# EAGLE design rev2.3.2 (EAGLE 9.3.0)
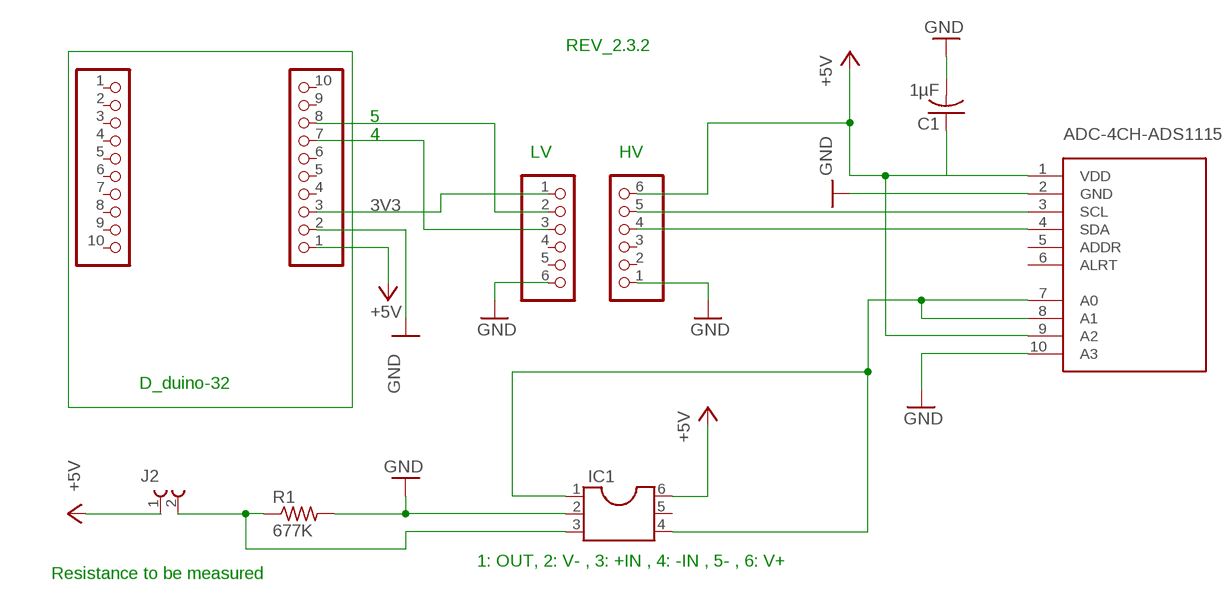
[diagram p0: schematic, sheet 1]

## Parts
C1  1µF  C-US025-025X050  [C025-025X050]
IC1  DIL6S  [SOCKET-06]
J2  691103110002  [691103110002]
JP1  PINHD-1X6  [1X06]
JP3  PINHD-1X10  [1X10]
JP4  PINHD-1X6  [1X06]
JP5  PINHD-1X10  [1X10]
R1  677K  R-US_0204/5  [0204/5]
U$1  ADC-4CH-ADS1115  [ADC-4CH-ADS1115]

## Nets
3V3: JP1.1
4: JP1.3
+5V: IC1.6 J2.1
A1: IC1.1 IC1.4 U$1.7(A0) U$1.8(A1)
GND: C1.2 IC1.2 JP1.6 JP4.1 JP5.2 R1.2 U$1.2(GND) U$1.10(A3)
N$1: IC1.3 J2.2 R1.1
N$2: JP1.2 JP5.8
N$3: U$1.1(VDD)
N$5: JP4.5 U$1.3(SCL)
N$6: JP4.4 U$1.4(SDA)
VDD: C1.1 JP4.6 U$1.9(A2) ; supply symbol labelled +5V
Unconnected: IC1.5 JP1.4 JP1.5 JP3.1 JP3.2 JP3.3 JP3.4 JP3.5 JP3.6 JP3.7 JP3.8 JP3.9 JP3.10 JP4.2 JP4.3 JP5.1 JP5.3 JP5.4 JP5.5 JP5.6 JP5.7 JP5.9 JP5.10 U$1.5(ADDR) U$1.6(ALRT)

## Notes on the sheet
- REV_2.3.2
- 5
- 4
- LV | HV
- D_duino-32
- Resistance to be measured | 1: OUT, 2: V- , 3: +IN , 4: -IN , 5- , 6: V+

## Library data of the parts
C1 = adafruit:C-US: CAPACITOR, American symbol
IC1 = ic-package:DIL6: Dual In Line / Socket
J2 = Wurth_Elektronik_Electromechanic_Terminal_Blocks_Connectors_rev18a:691103110002: WR-TBL Serie 1031 - 3.5mm Horizontal Entry Modular with Pressure Clamp - 1.5mm2 Wires, 2 Pins=>Code : Con_TBL_Screw_PressureClamp_6911103110002 <http://katalog.we-online.de/media/images/eican/Con_TBL_Screw_PressureClamp_69111031100xx_pf2.jpg> Details see: http://katalog.we-online.de/en/em/691_103_110_0xx Created 2014-06-16, Karrer Zheng 2014 (C) Würth Elektronik
JP1 JP4 = pinhead:PINHD-1X6: PIN HEADER
JP3 JP5 = pinhead:PINHD-1X10: PIN HEADER
R1 = adafruit:R-US_: RESISTOR, American symbol
U$1 = diy-modules:ADC-4CH-ADS1115: 4 Channel 16-Bit Analog-to-Digital Converter based on ADS1115 chip Arduino ADS1115 Getting Started Tutorial is available here: http://henrysbench.capnfatz.com/henrys-bench/arduino-voltage-measurements/arduino-ads1115-module-getting-started-tutorial/ ADS1115 datasheet is available here: http://www.ti.com/lit/ds/symlink/ads1115.pdf Click here to find device on ebay.com <http://www.ebay.com/sch/ads1115+module>

## Net classes
0 default: width 0.559 mm, drill 0.508 mm, clearance 0.381 mm

## Board
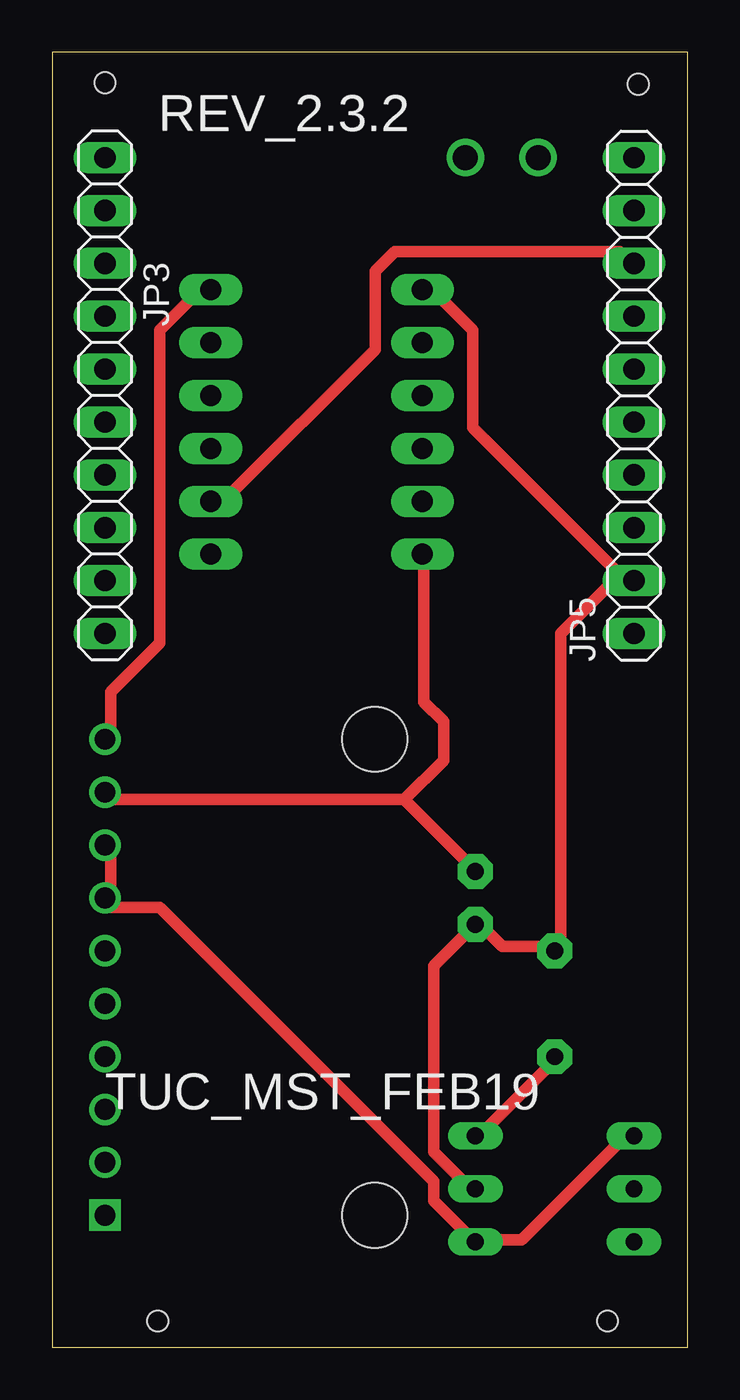
[diagram p1: board, top side]
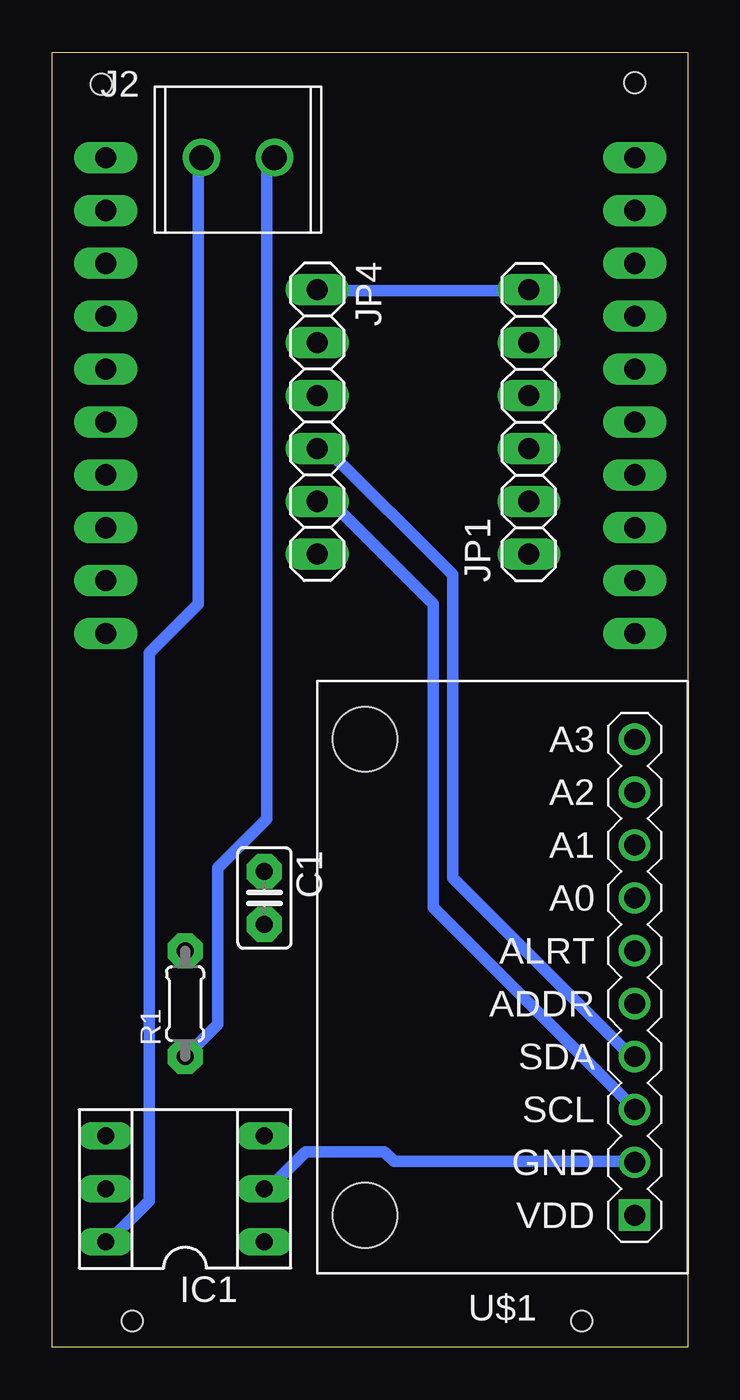
[diagram p2: board, bottom side, seen from below]

Size 30.51 x 62.22 mm. Coordinates in mm from the lower left corner, seen from the top.
Outline: 0,0 30.52,0 30.52,62.22 0,62.22 0,0
Copper layers (1*16): Top 0.035mm / dielectric 1.5mm / Bottom 0.035mm
Design rules "default": minimum track width 6mil, minimum drill 0.35mm, track to track 6mil, track to pad 6mil, pad to pad 6mil, via to via 6mil, smd to smd 6mil, copper to edge 40mil, drill to drill 6mil, minimum pad ring 10mil, minimum via ring 8mil, stop-mask expansion 4mil, vias tented up to drill 0mil, thermal gap 10mil
Holes 1 mm at 2.54,60.75 28.15,60.68 5.08,1.27 26.67,1.27

### Footprints (pad centres in the part's own frame; a part is rotated, then mirrored left to right if it is on the bottom)
C025-025X050 = drill 0.813 pad 1.676 octagon: 1 -1.27,0; 2 1.27,0
SOCKET-06 = drill 0.813 long: 1 -2.54,-3.81; 2 0,-3.81; 3 2.54,-3.81; 4 2.54,3.81; 5 0,3.81; 6 -2.54,3.81
691103110002 = drill 1.2: 1 -1.75,0; 2 1.75,0
1X06 = drill 1.016 long: 1 -6.35,0; 2 -3.81,0; 3 -1.27,0; 4 1.27,0; 5 3.81,0; 6 6.35,0
1X10 = drill 1.016 long: 1 -11.43,0; 2 -8.89,0; 3 -6.35,0; 4 -3.81,0; 5 -1.27,0; 6 1.27,0; 7 3.81,0; 8 6.35,0; 9 8.89,0; 10 11.43,0
0204/5 = drill 0.813 pad 1.676 octagon: 1 -2.54,0; 2 2.54,0
ADC-4CH-ADS1115 = drill 1 square: 1 -6.35,11.43 | drill 1: 2 -6.35,8.89; 3 -6.35,6.35; 4 -6.35,3.81; 5 -6.35,1.27; 6 -6.35,-1.27; 7 -6.35,-3.81; 8 -6.35,-6.35; 9 -6.35,-8.89; 10 -6.35,-11.43 | hole 3.1: 6.604,11.43; 6.604,-11.43

### Placement (x,y rotation side)
C1  20.32,21.59 270 bottom
IC1  24.13,7.62 90 bottom
J2  21.59,57.15 0 bottom
JP1  7.62,44.45 90 bottom
JP3  2.54,45.72 270 top
JP4  17.78,44.45 270 bottom
JP5  27.94,45.72 90 top
R1  24.13,16.51 90 bottom
U$1  8.89,17.78 180 bottom

### Tracks (layer width: path | path; a pad name or v marks a point on that pad's centre or on a via)
+5V
  Bottom 0.559: IC1.6 27.72,5.17 25.84,7.05 25.84,33.36 23.5,35.71 23.5,56.86 J2.1
A1
  Top 0.559: U$1.8 2.82,23.96 2.82,21.61 U$1.7 2.82,21.14 5.17,21.14 18.33,7.99 18.33,7.05 20.21,5.17 IC1.1 20.68,5.17 22.55,5.17 27.72,10.34 IC1.4
GND
  Top 0.559: IC1.2 20.21,7.99 19.74,7.99 18.33,9.4 18.33,18.33 C1.2 20.68,20.21 21.61,19.27 23.96,19.27 R1.2 24.43,19.27 24.43,34.3 27.25,37.12 | U$1.10 2.82,29.6 2.82,31.48 5.17,33.83 5.17,48.87 7.52,51.22 JP1.6 | 27.25,37.12 27.72,37.12 JP5.2 27.25,37.12 | 27.25,37.12 20.21,44.17 20.21,48.87 17.86,51.22 JP4.1
  Bottom 0.559: U$1.2 2.82,8.93 14.1,8.93 14.57,9.4 18.33,9.4 20.21,7.52 IC1.2 | JP4.1 17.39,50.75 7.99,50.75 JP1.6
N$1
  Top 0.559: IC1.3 20.68,10.34 23.96,13.63 R1.1
  Bottom 0.559: J2.2 20.21,56.86 20.21,25.38 22.55,23.02 22.55,15.51 23.96,14.1 R1.1
N$2
  Top 0.559: JP1.2 7.99,40.88 8.46,40.88 15.51,47.93 15.51,51.69 16.45,52.63 27.25,52.63 27.72,52.16 JP5.8
N$5
  Bottom 0.559: U$1.3 2.82,11.75 12.22,21.14 12.22,35.71 17.39,40.88 JP4.5
N$6
  Bottom 0.559: U$1.4 2.82,14.1 11.28,22.55 11.28,37.12 17.39,43.23 JP4.4
VDD
  Top 0.559: 16.92,26.31 2.82,26.31 U$1.9 | 16.92,26.31 20.21,23.02 C1.1 | 16.92,26.31 18.8,28.19 18.8,30.07 17.86,31.01 17.86,38.06 JP4.6

### Text on the board
tPlace: REV_2.3.2 | TUC_MST_FEB19